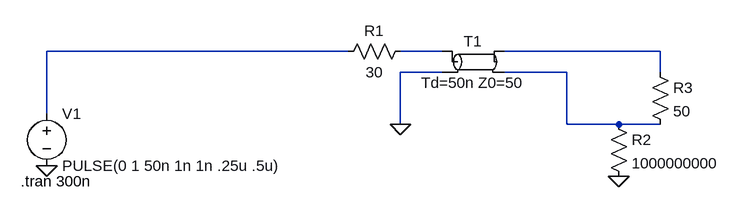
[diagram p0: schematic Tline Test.asc]
Tline Test.asc, the LTspice schematic file:
Version 4.1
SHEET 1 1288 680
WIRE 704 32 240 32
WIRE 848 32 784 32
WIRE 1184 32 944 32
WIRE 848 64 784 64
WIRE 1040 64 944 64
WIRE 1184 64 1184 32
WIRE 240 128 240 32
WIRE 784 144 784 64
WIRE 1040 144 1040 64
WIRE 1120 144 1040 144
WIRE 1184 144 1120 144
FLAG 784 144 0
FLAG 240 208 0
FLAG 1120 224 0
SYMBOL voltage 240 112 R0
WINDOW 123 0 0 Left 0
WINDOW 39 0 0 Left 0
SYMATTR InstName V1
SYMATTR Value PULSE(0 1 50n 1n 1n .25u .5u)
SYMBOL res 800 16 R90
WINDOW 0 0 56 VBottom 2
WINDOW 3 32 56 VTop 2
SYMATTR InstName R1
SYMATTR Value 30
SYMBOL tline 896 48 R0
SYMATTR InstName T1
SYMBOL res 1168 48 R0
SYMATTR InstName R3
SYMATTR Value 50
SYMBOL res 1104 128 R0
SYMATTR InstName R2
SYMATTR Value 1000000000
TEXT 200 232 Left 2 !.tran 300n

The netlist it stands for:
* Tline Test.asc
V1 N001 0 PULSE(0 1 50n 1n 1n .25u .5u)
R1 N002 N001 30
T1 N002 0 N003 N004 Td=50n Z0=50
R3 N003 N004 50
R2 N004 0 1000000000
.tran 300n
.backanno
.end